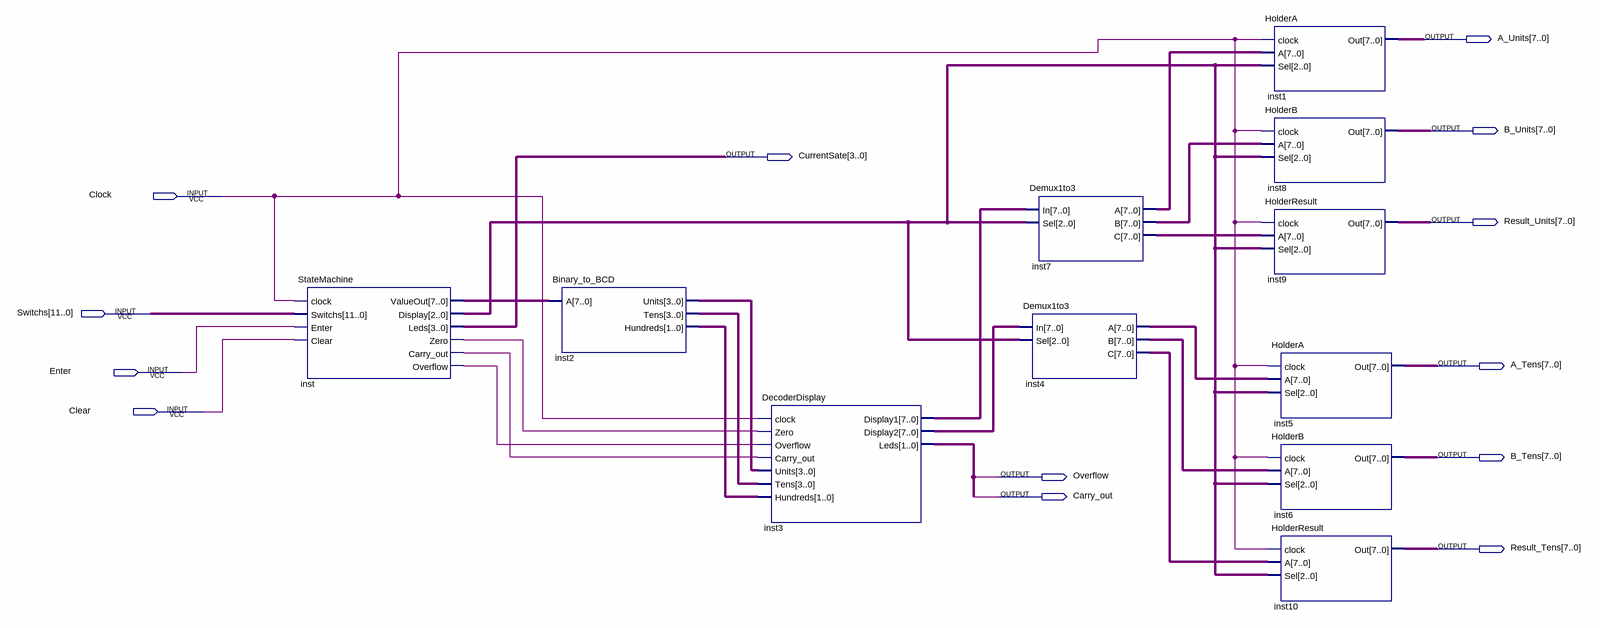
[diagram p0: schematic sheet]
// Quartus schematic CalculatorSchematic.bdf as structural Verilog: 11 symbols, 13 pins
module CalculatorSchematic (
  input  Clock,
  input  [11:0] Switchs,
  input  Enter,
  input  Clear,
  output [7:0] A_Units,
  output [7:0] B_Units,
  output [3:0] CurrentSate,
  output [7:0] Result_Units,
  output [7:0] A_Tens,
  output [7:0] B_Tens,
  output Overflow,
  output Carry_out,
  output [7:0] Result_Tens
);

  wire inst_carry_out, inst_overflow, inst_zero;
  wire [1:0] inst2_hundreds, inst3_leds;
  wire [2:0] inst_display;
  wire [3:0] inst2_tens, inst2_units;
  wire [7:0] inst3_display1, inst3_display2, inst4_a, inst4_b, inst4_c, inst7_a, inst7_b, inst7_c,
       inst_valueout;

  StateMachine inst (
    .clock(Clock), .Switchs(Switchs), .Enter(Enter), .Clear(Clear), .ValueOut(inst_valueout),
    .Display(inst_display), .Leds(CurrentSate), .Zero(inst_zero), .Carry_out(inst_carry_out),
    .Overflow(inst_overflow));
  Binary_to_BCD inst2 (.A(inst_valueout), .Units(inst2_units), .Tens(inst2_tens), .Hundreds(inst2_hundreds));
  DecoderDisplay inst3 (
    .clock(Clock), .Zero(inst_zero), .Overflow(inst_overflow), .Carry_out(inst_carry_out),
    .Units(inst2_units), .Tens(inst2_tens), .Hundreds(inst2_hundreds), .Display1(inst3_display1),
    .Display2(inst3_display2), .Leds(inst3_leds));
  Demux1to3 inst4 (.In(inst3_display2), .Sel(inst_display), .A(inst4_a), .B(inst4_b), .C(inst4_c));
  Demux1to3 inst7 (.In(inst3_display1), .Sel(inst_display), .A(inst7_a), .B(inst7_b), .C(inst7_c));
  HolderA inst1 (.clock(Clock), .A(inst7_a), .Sel(inst_display), .Out(A_Units));
  HolderB inst8 (.clock(Clock), .A(inst7_b), .Sel(inst_display), .Out(B_Units));
  HolderResult inst9 (.clock(Clock), .A(inst7_c), .Sel(inst_display), .Out(Result_Units));
  HolderA inst5 (.clock(Clock), .A(inst4_a), .Sel(inst_display), .Out(A_Tens));
  HolderB inst6 (.clock(Clock), .A(inst4_b), .Sel(inst_display), .Out(B_Tens));
  HolderResult inst10 (.clock(Clock), .A(inst4_c), .Sel(inst_display), .Out(Result_Tens));
endmodule
